# Altium schematic sheet usb.SchDoc: USB interfaces
size A3; Author: Olexandr Gudozhnik; Organization: EPFL-STI-LIS; Address1: EPFL, Station 9; Address2: 1015 Lausanne; Address3: Switzerland; DocumentNumber: 5; SheetNumber: 5; SheetTotal: 8
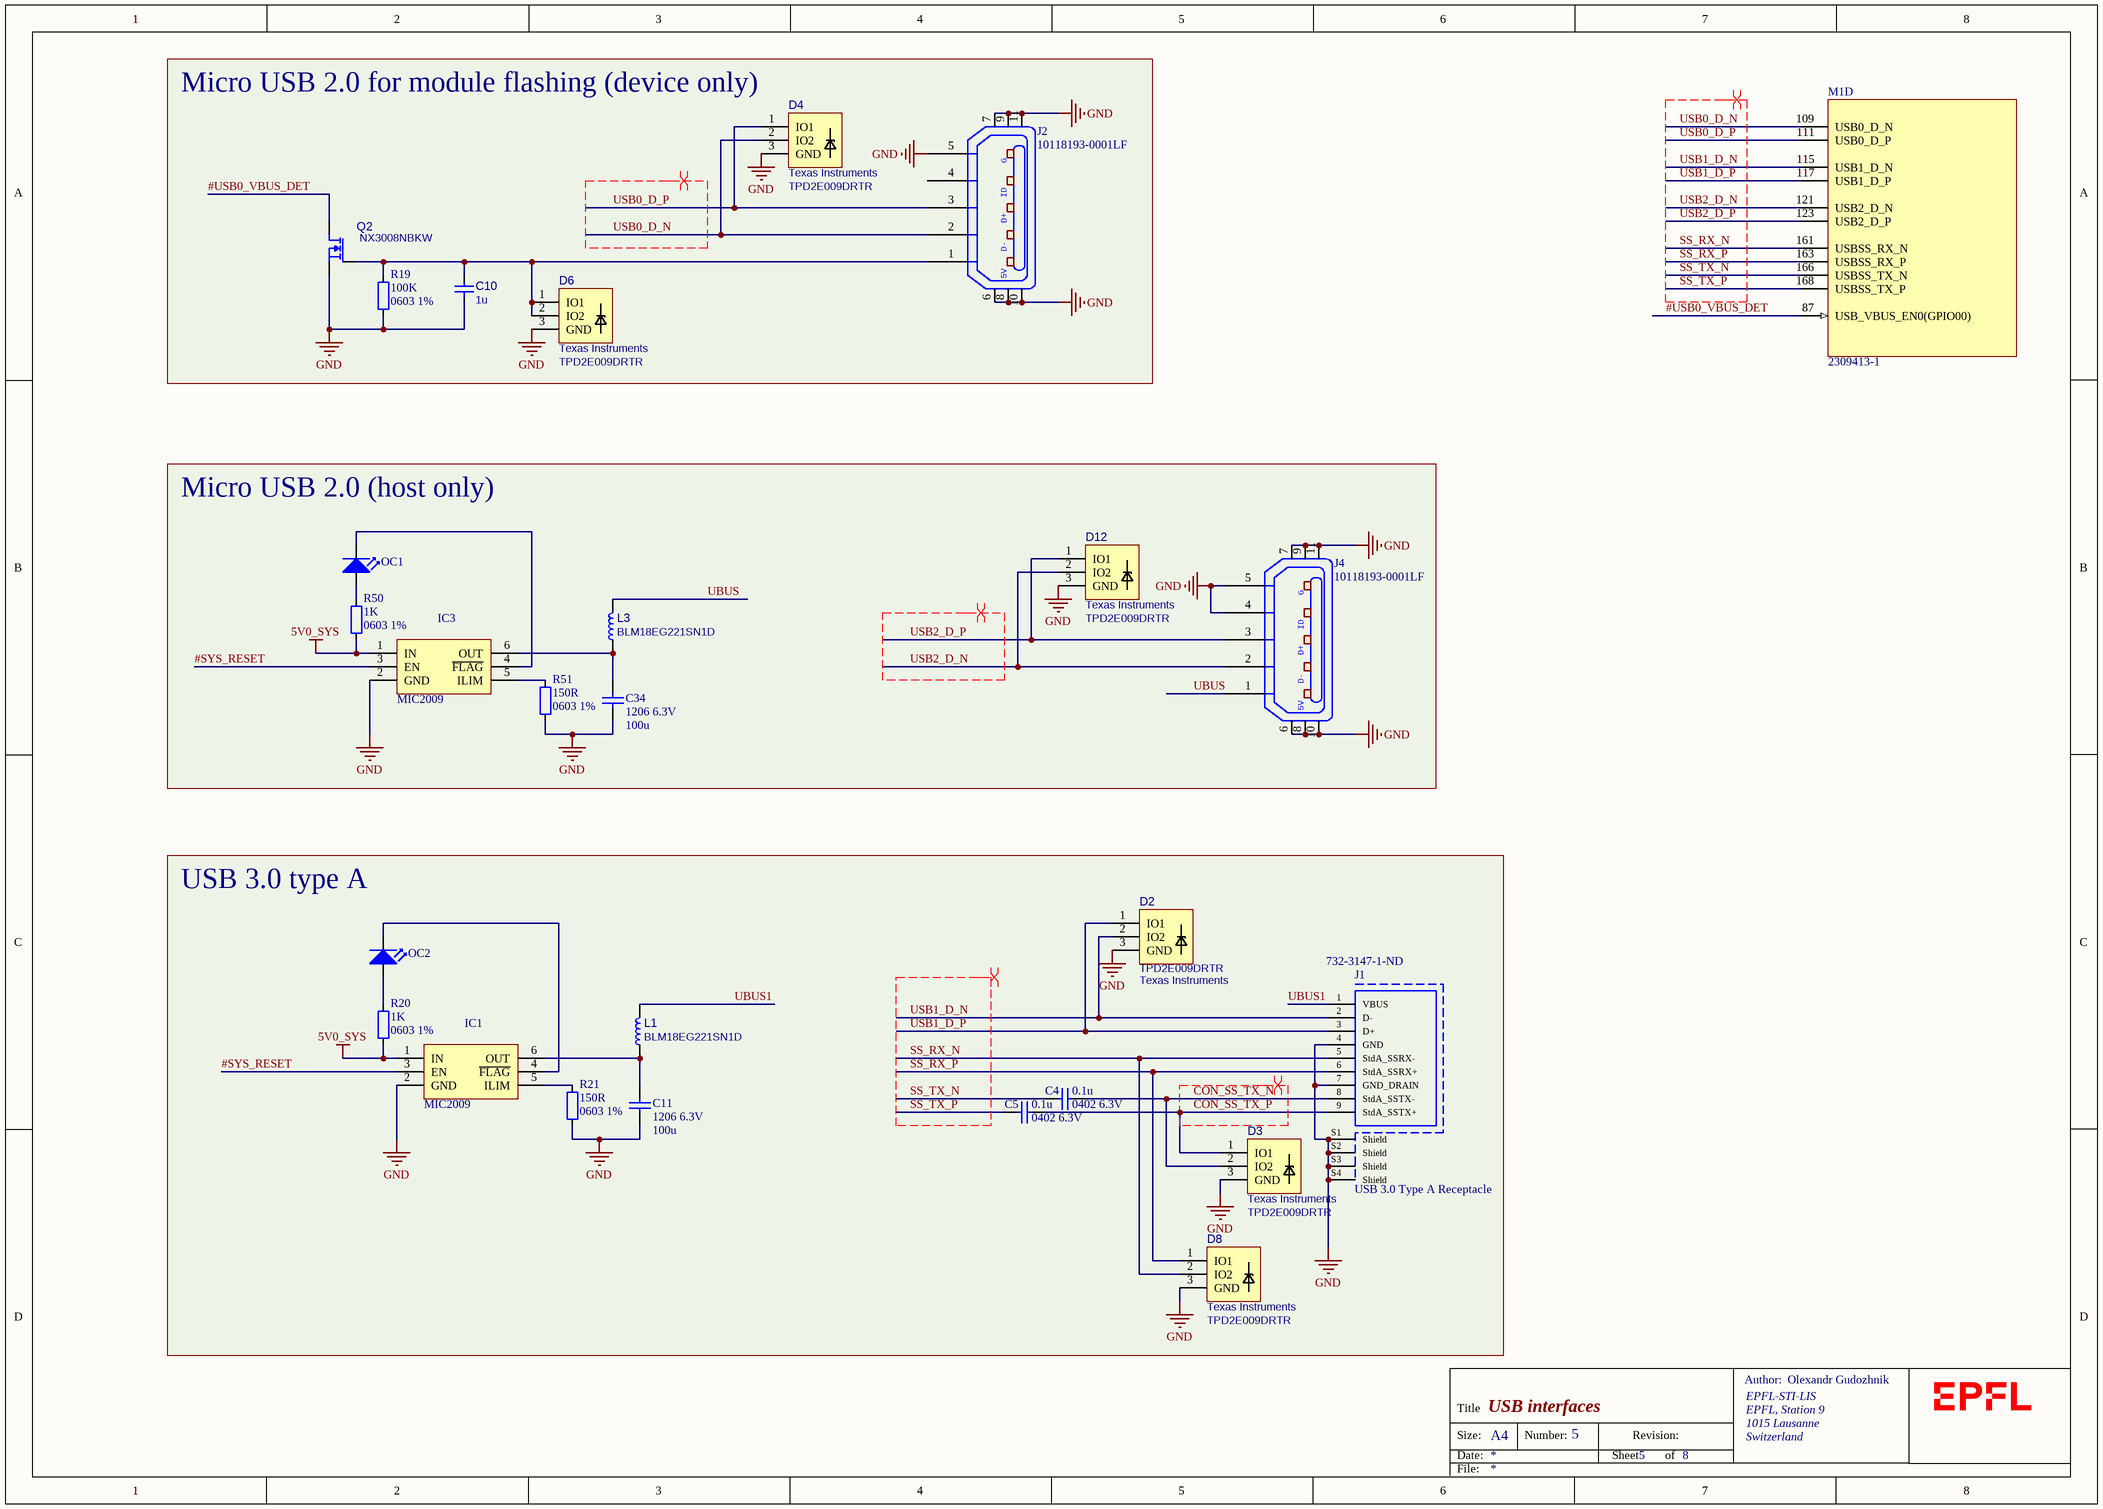
[diagram p0: usb.SchDoc]

## Parts
C4  0402 6.3V  value 0.1u  [cap0402]
C5  0402 6.3V  value 0.1u  [cap0402]
C10  1u  [0402]
C11  1206 6.3V  value 100u  [cap1206]
C34  1206 6.3V  value 100u  [cap1206]
D2  TPD2E009DRTR  Manufacturer: Texas Instruments  [SOT-3]
D3  TPD2E009DRTR  Manufacturer: Texas Instruments  [SOT-3]
D4  TPD2E009DRTR  Manufacturer: Texas Instruments  [SOT-3]
D6  TPD2E009DRTR  Manufacturer: Texas Instruments  [SOT-3]
D8  TPD2E009DRTR  Manufacturer: Texas Instruments  [SOT-3]
D12  TPD2E009DRTR  Manufacturer: Texas Instruments  [SOT-3]
IC1  MIC2009  [TSOP-6]
IC3  MIC2009  [TSOP-6]
J1  USB 3.0 Type A Receptacle  Supplier Part Number 1: 732-3147-1-ND  [692121230100]
J2  10118193-0001LF  [micro_usb_TH_RA_10118193]
J4  10118193-0001LF  [micro_usb_TH_RA_10118193]
L1  BLM18EG221SN1D  [fb0603]
L3  BLM18EG221SN1D  [fb0603]
M1  2309413-1  [jetson-nano-connector]  (part D of 7)
OC1  diode_LED  [led_0603]  (value not drawn)
OC2  diode_LED  [led_0603]  (value not drawn)
Q2  NX3008NBKW  [SC70-3]
R19  0603 1%  value 100K  [res0603]
R20  0603 1%  value 1K  [res0603]
R21  0603 1%  value 150R  [res0603]
R50  0603 1%  value 1K  [res0603]
R51  0603 1%  value 150R  [res0603]

## Blocks framed on the sheet
Micro USB 2.0 for module flashing (device only): C10 D4 D6 J2 Q2 R19
Micro USB 2.0 (host only): C34 D12 IC3 J4 L3 OC1 R50 R51
USB 3.0 type A: C4 C5 C11 D2 D3 D8 IC1 J1 L1 OC2 R20 R21

## Nets
5V0_SYS: IC1.1(IN) IC3.1(IN) R20.1 R50.1
GND: C10.1 C11.1 C34.1 D2.3(GND) D3.3(GND) D4.3(GND) D6.3(GND) D8.3(GND) D12.3(GND) IC1.2(GND) IC3.2(GND) J1.4(GND) J1.7(GND_DRAIN) J1.S1(Shield) J1.S2(Shield) J1.S3(Shield) J1.S4(Shield) J2.5(P5) J2.6 J2.7 J2.8 J2.9 J2.10 J2.11 J4.4(P4) J4.5(P5) J4.6 J4.7 J4.8 J4.9 J4.10 J4.11 Q2.2(S) R19.1 R21.1 R51.1
#SYS_RESET: IC1.3(EN) IC3.3(EN)
#USB0_VBUS_DET: M1.87(USB_VBUS_EN0(GPIO00)) Q2.3(D)
CON_SS_TX_N: C4.2 D3.2(IO2) J1.8(StdA_SSTX-)
CON_SS_TX_P: C5.2 D3.1(IO1) J1.9(StdA_SSTX+)
SS_RX_N: D8.2(IO2) J1.5(StdA_SSRX-) M1.161(USBSS_RX_N)
SS_RX_P: D8.1(IO1) J1.6(StdA_SSRX+) M1.163(USBSS_RX_P)
SS_TX_N: C4.1 M1.166(USBSS_TX_N)
SS_TX_P: C5.1 M1.168(USBSS_TX_P)
UBUS: J4.1(P1) L3.2
UBUS1: J1.1(VBUS) L1.2
USB0_D_N: D4.2(IO2) J2.2(P2) M1.109(USB0_D_N)
USB0_D_P: D4.1(IO1) J2.3(P3) M1.111(USB0_D_P)
USB1_D_N: D2.2(IO2) J1.2(D-) M1.115(USB1_D_N)
USB1_D_P: D2.1(IO1) J1.3(D+) M1.117(USB1_D_P)
USB2_D_N: D12.2(IO2) J4.2(P2) M1.121(USB2_D_N)
USB2_D_P: D12.1(IO1) J4.3(P3) M1.123(USB2_D_P)
NetC10_2: C10.2 D6.1(IO1) D6.2(IO2) J2.1(P1) Q2.1(G) R19.2
NetC11_2: C11.2 IC1.6(OUT) L1.1
NetC34_2: C34.2 IC3.6(OUT) L3.1
NetIC1_4: IC1.4(~{FLAG}) OC2.2(K)
NetIC1_5: IC1.5(ILIM) R21.2
NetIC3_4: IC3.4(~{FLAG}) OC1.2(K)
NetIC3_5: IC3.5(ILIM) R51.2
NetOC1_1: OC1.1(A) R50.2
NetOC2_1: OC2.1(A) R20.2

Not connected (* = marked no-connect by the designer): J2 4(P4)

## Layout directives
differential pair; differential pair class DIFF90: CON_SS_TX_N, CON_SS_TX_P, SS_RX_N, SS_RX_P, SS_TX_N, SS_TX_P, USB0_D_N, USB0_D_P, USB1_D_N, USB1_D_P, USB2_D_N, USB2_D_P

## Notes on the sheet
- Author:
- Title
- Size:
- Date:
- A4
- Number:
- Sheet
- Revision:
- of
- File:
- (in symbol 10118193-0001LF) G; ID; D+; D-; 5V

## Library data of the parts
C4 C5 C11 C34 = cap_no_param: Supplier 1: Digi-Key
  C4 C5: Supplier Part Number 1: 490-14603-1-ND
  C11 C34: Supplier Part Number 1: 399-5620-1-ND
C10 = C_1u_0402: MLCC SMT Capacitor 1uF 0402; Manufacturer: MULTICOMP; PartSymbol: MC0402F105Z6R3CT; PartNumber: C_1u_0402; Value: 1u; Supplier 1: Digi-Key; Supplier Part Number 1: 445-9066-1-ND
D2-D4 D6 D8 D12 = TPD2E009: ESD Suppressors 2-CH; PartNumber: TPD2E009DRTR; Value: TPD2E009DRTR; PartSymbol: TPD2E009DRTR; Supplier 1: Digi-Key; Supplier Part Number 1: 296-25410-1-ND
IC1 IC3 = NCP380HSNAJAAT1G: POWER LOAD SWITCH, HIGH SIDE; Manufacturer: ON Semiconductor; Value: MIC2009; PartNumber: NCP380HSNAJAAT1G; PartSymbol: NCP380HSNAJAAT1G; Supplier 1: Digi-Key; Supplier Part Number 1: 576-1680-1-ND
J1 = 692121230100: USB 3.0 Type A, Receptacle, Horizontal, THR, with Offset 1.04mm; Rated Current: 1.8A; Pin Number: 9; Interface Type: Type A; Working Voltage: 30VAC; ComponentLink1Description: Manufacturer; ComponentLink1URL: http://www.we-online.de; ComponentLink2Description: Datasheet; ComponentLink2URL: https://katalog.we-online.com/em/datasheet/692121230100.pdf; Published Date: September 2019; Publisher: Wurth Elektronik; Part Number: 692121230100; Gender: Receptacle; Type: Horizontal; Packaging: Tape and Reel; Operating Temperature: -20 to +85degC; Mounting Technology: THR; Application: USB 3.0; Supplier 1: Digi-Key
J2 J4 = 10118193-0001LF: CONN USB MICRO B RECPT SMT+TH R/A; Manufacturer: FCI; Connector Type: USB - micro B; Number of Contacts: 5; Gender: Receptacle; Specifications: USB 2.0; .Creator: MM; .Checked PCB: RF; Supplier 1: Digi-Key; Manufacturer Part Number: 10118193-0001LF; RoHS: RoHS Compliant; Category: Connectors, Interconnects; Stock 1: 28642; Pricing 1: 1=0.46, 10=0.433, 25=0.3712, 50=0.3156, 100=0.3032, 250=0.27224, 500=0.25988 (USD); Packaging: Cut Tape (CT); Mounting Type: Surface Mount, Right Angle, Horizontal; Features: Shielded, Solder Retention; Ingress Protection: -; ComponentLink1URL: http://portal.fciconnect.com/Comergent//fci/drawing/10118193.pdf; ComponentLink1Description: http://portal.fciconnect.com/Comergent//fci/drawing/10118193.pdf; Supplier Part Number 1: 609-4616-1-ND; .Checked SCH: MM
L1 L3 = BLM18EG221SN1D: MURATA  BLM18EG221SN1D  FERRITE BEAD, 0.05OHM, 2A, 0603; Value: BLM18EG221SN1D; Manufacturer: MURATA; PartNumber: BLM18EG221SN1D; PartSymbol: BLM18EG221SN1D; Supplier 1: Digi-Key; Supplier Part Number 1: 490-3992-1-ND
M1 = 2309413-1: Memory Socket, DDR4, SODIMM Socket, 260 Contacts, Copper Alloy, Gold Plated Contacts; Manufacturer: TE CONNECTIVITY; PartNumber: 2309413-1; Value: 2309413-1; PartSymbol: 2309413-1
OC1 OC2 = diode_LED: standard LED; Supplier 1: Digi-Key; Supplier Part Number 1: 475-2506-1-ND
Q2 = NMOS: MOSFET, N CH, 60V, 0.2A; Manufacturer: NXP; PartSymbol: BSS138PW; Value: NX3008NBKW; PartNumber: NX3008NBKW; Supplier 1: Digi-Key; Supplier Part Number 1: 1727-1280-1-ND
R19-R21 R50 R51 = res: 100K; Supplier 1: Digi-Key
  R19: Supplier Part Number 1: 311-100KHRCT-ND
  R20 R50: Supplier Part Number 1: 311-1.00KHRCT-ND
  R21 R51: Supplier Part Number 1: 311-150HRCT-ND